# Altium schematic sheet PuppyLight.SchDoc
size 209 x 148 mm; DocumentNumber: 1; SheetNumber: 1; SheetTotal: 1
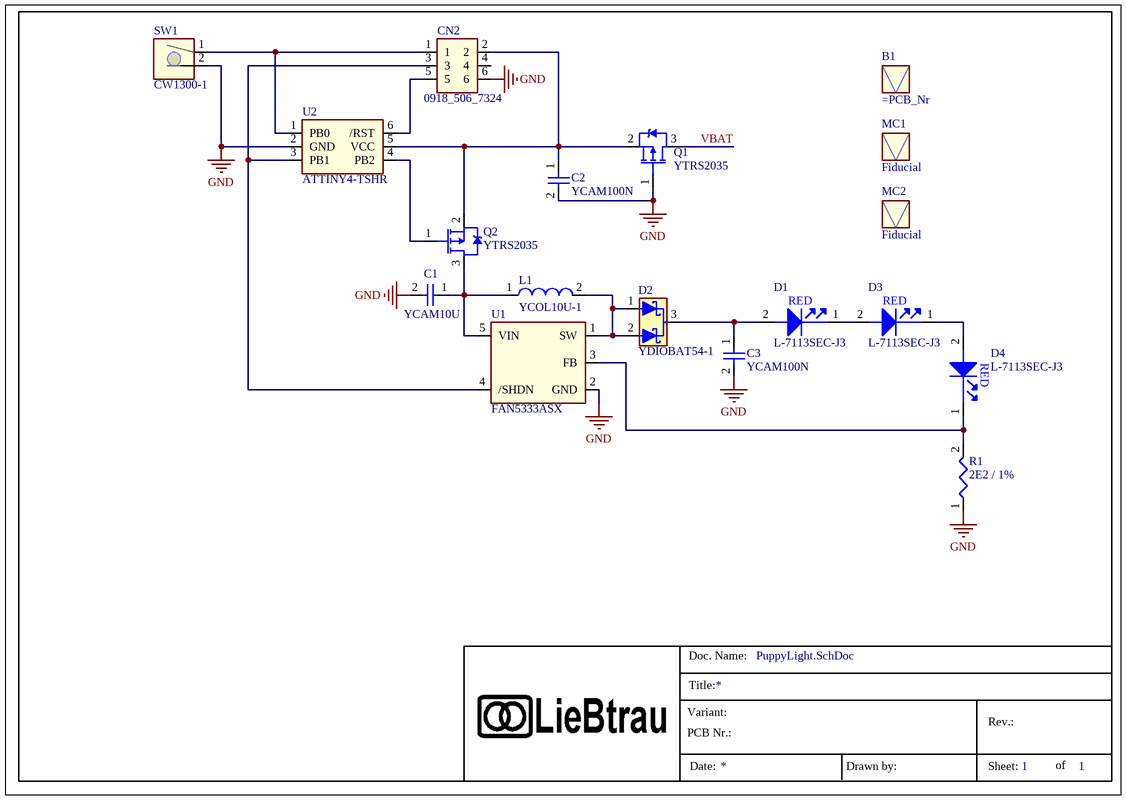
[diagram p0: PuppyLight.SchDoc]

## Parts
B1  (no value)  [MC_BoardNr]
C1  YCAM10U  [CA_1206]
C2  YCAM100N  [CA_1206]
C3  YCAM100N  [CA_1206]
CN2  0918_506_7324  [CN_HARTING_918506X324]
D1  L-7113SEC-J3  [DI_LED_5MM]
D2  YDIOBAT54-1  [SC_SOT23]
D3  L-7113SEC-J3  [DI_LED_5MM]
D4  L-7113SEC-J3  [DI_LED_5MM]
L1  YCOL10U-1  [CL_VISHAY_IHLP-2525CZ-01]
MC1  Fiducial  [MC_FIDUCIAL]  (no BOM)
MC2  Fiducial  [MC_FIDUCIAL]  (no BOM)
Q1  YTRS2035  [SC_SOT23]
Q2  YTRS2035  [SC_SOT23]
R1  2E2 / 1%  [RE_1206]
SW1  CW1300-1  [SW_TILT_Comus_CW1300-1]
U1  FAN5333ASX  [SC_SOT23-5AM]
U2  ATTINY4-TSHR  [SC_SOT23-6]

## Nets
GND: C1.2 C2.2 C3.2 CN2.6 Q1.1(G) R1.1 SW1.2 U1.2(GND) U2.2(GND)
VBAT: Q1.3(D)
NetC1_1: C1.1 L1.1 Q2.3(D) U1.5(VIN)
NetC2_1: C2.1 CN2.2 Q1.2(S) Q2.2(S) U2.5(VCC)
NetC3_1: C3.1 D1.2(C) D2.3(C)
NetCN2_1: CN2.1 SW1.1 U2.1(PB0)
NetCN2_3: CN2.3 U1.4(/SHDN) U2.3(PB1)
NetCN2_5: CN2.5 U2.6(/RST)
NetD1_1: D1.1(A) D3.2(C)
NetD2_1: D2.1(A1) D2.2(A2) L1.2 U1.1(SW)
NetD3_1: D3.1(A) D4.2(C)
NetD4_1: D4.1(A) R1.2 U1.3(FB)
NetQ2_1: Q2.1(G) U2.4(PB2)

Not connected (* = marked no-connect by the designer): CN2 4

## Notes on the sheet
- Title:
- Doc. Name:
- Variant:
- PCB Nr.:
- Rev.:
- Date:
- Drawn by:
- Sheet:
- of
- (in symbol L-7113SEC-J3) RED

## Library data of the parts
B1 = BARE_PCB: Part Number: BARE_PCB; Order Code: =PCB_Nr
C1 = YCAM10U: Order Code: Farnell 1828807; Part Number: YCAM10U; Component Type: capacitor
C2 C3 = YCAM100N: Order Code: Farnell 1759361; Part Number: YCAM100N; Component Type: capacitor
CN2 = 0918_506_7324: Manufacturer: Harting; Order Code: Farnell 1096984; Part Number: 0918_506_7324; Component Type: connector
D1 D3 D4 = L-7113SEC-J3: Manufacturer: Kingbright; Order Code: Farnell 2080005; Part Number: L-7113SEC-J3; Component Type: led
D2 = YDIOBAT54-1: Dual Schottky Barrier Diode Common Cathode; Manufacturer: Fairchild Semiconductor; Order Code: Farnell 1467518; Part Number: YDIOBAT54-1; Component Type: diode
L1 = YCOL10U-1: Manufacturer: Vishay Dale; Order Code: Farnell 1692722; Part Number: YCOL10U-1; Component Type: inductor
Q1 Q2 = YTRS2035: Manufacturer: Diodes Inc.; Order Code: Farnell 2061419; Part Number: YTRS2035; Component Type: pmos
R1 = ASC1206-2R2FT5: Resistor; Manufacturer: Welwyn; Order Code: Farnell 2073867 / Farnell  2078984; Part Number: ASC1206-2R2FT5; Component Type: resistor
SW1 = CW1300-1: Manufacturer: Comus; Order Code: Farnell 540614; Part Number: CW1300-1; Component Type: switch
U1 = FAN5333ASX: Manufacturer: Fairchild Semi; Order Code: RS 802-3193; Part Number: FAN5333ASX; Component Type: power
U2 = ATTINY4-TSHR: Manufacturer: Atmel; Order Code: Farnell 1841625; Part Number: ATTINY4-TSHR; Component Type: microcontroller
MC1 MC2 = Fiducial: Part Number: Fiducial